# EAGLE schematic nixieShiftReg (EAGLE 9.0.1)
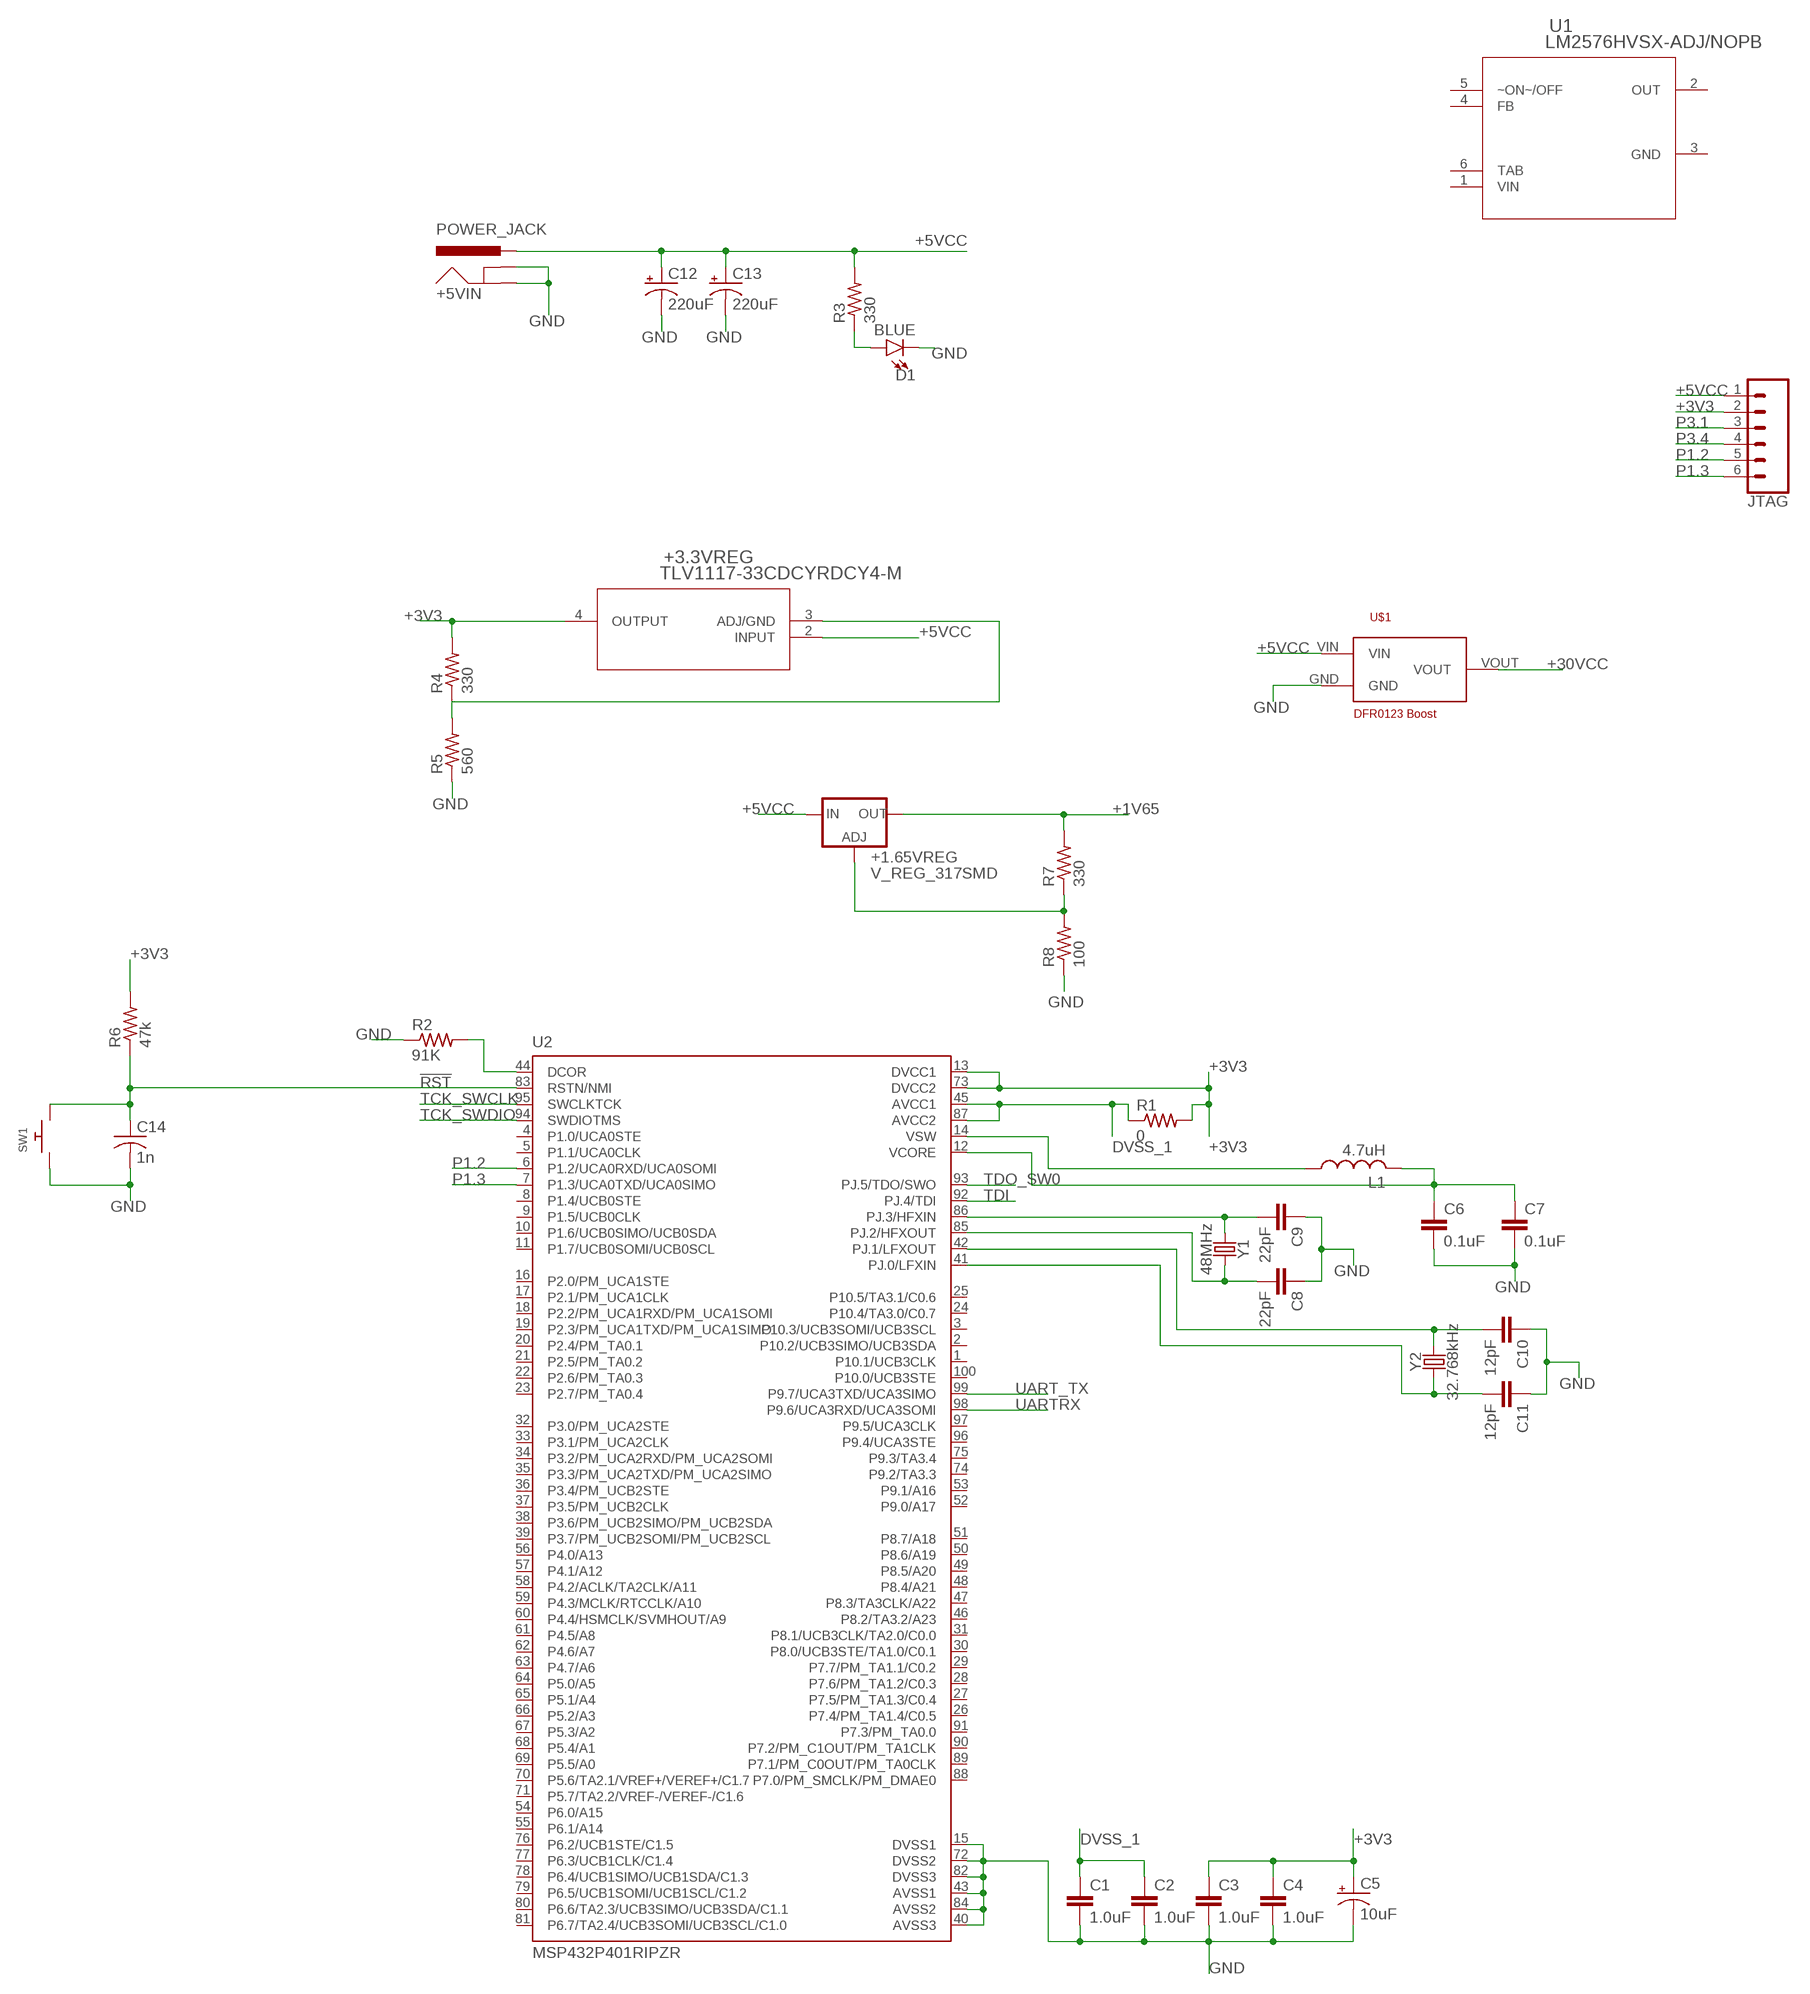
[diagram p0: schematic, sheet 1, part 1 of 2]
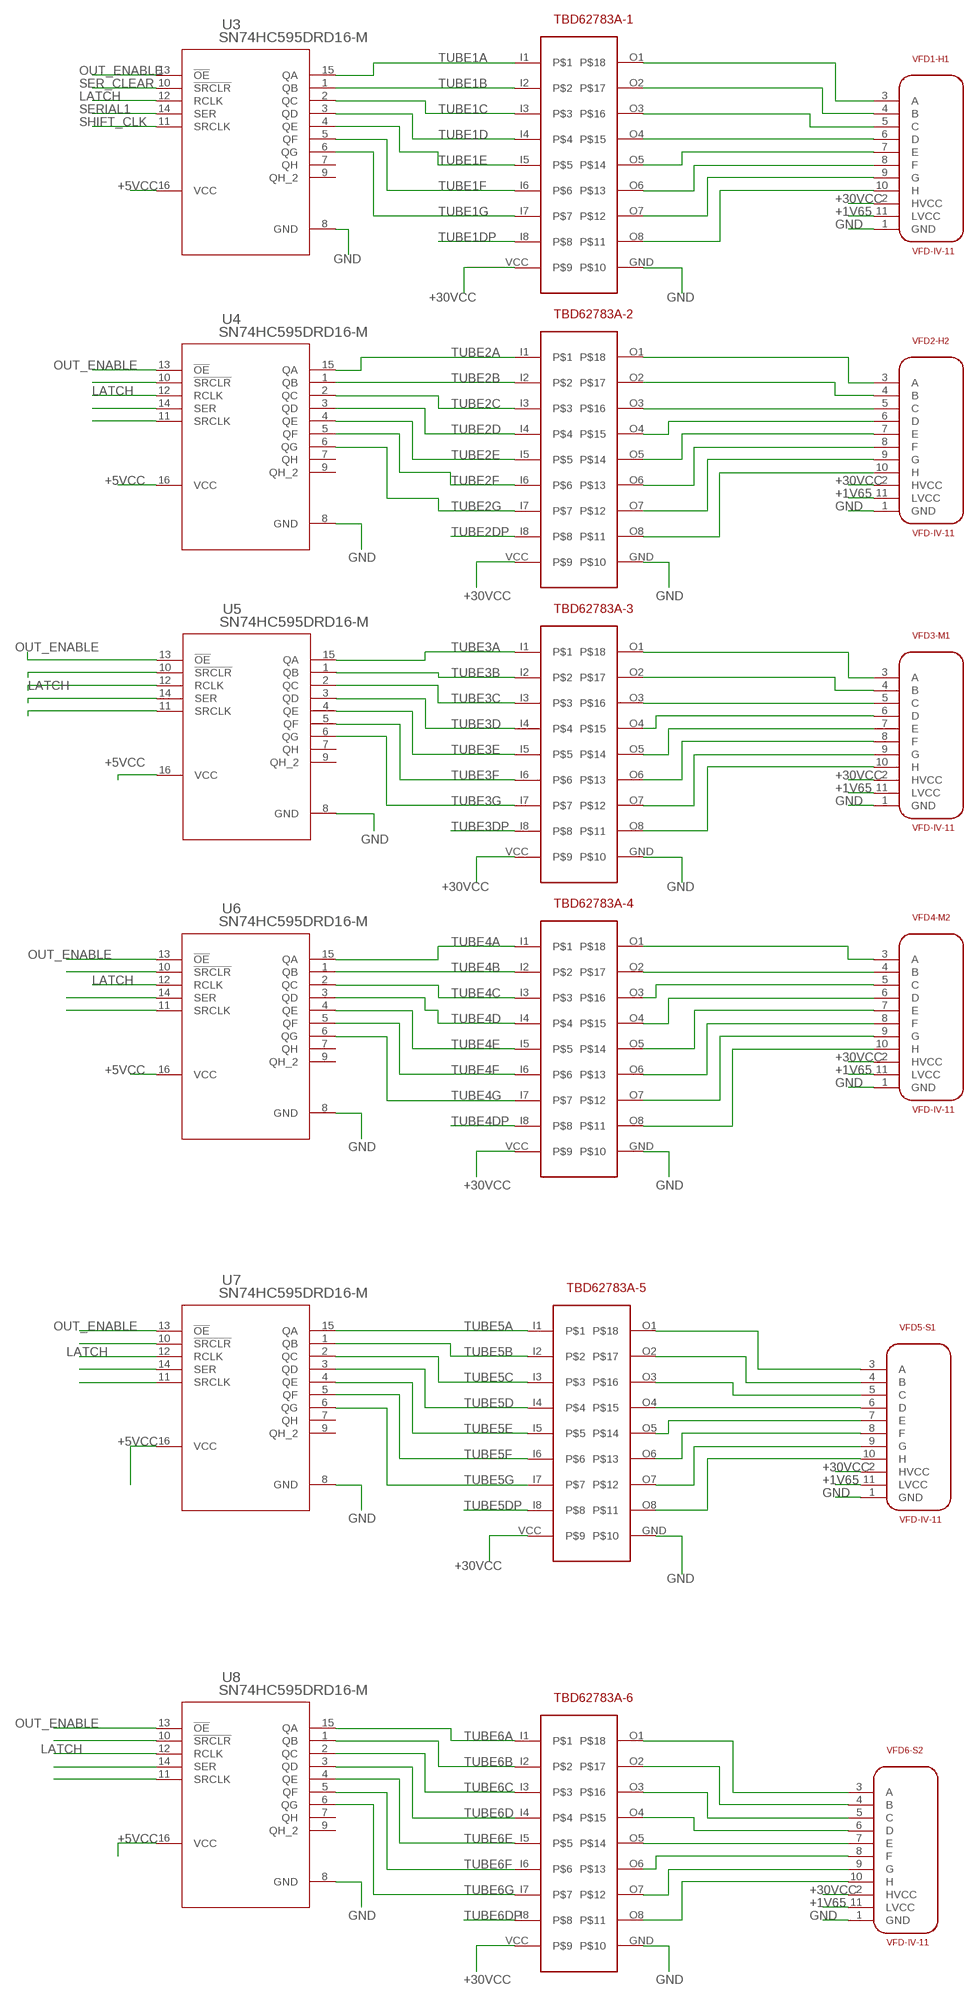
[diagram p1: schematic, sheet 1, part 2 of 2]

## Parts
+1.65VREG  V_REG_317SMD  [SOT223]
+3.3VREG  TLV1117-33CDCYRDCY4-M  [DCY4-M]
+5VIN  POWER_JACK  [POWER_JACK_PTH]
C1  1.0uF  1.0UF-0805-25V-(+80/-20%)  [0805]
C2  1.0uF  1.0UF-0805-25V-(+80/-20%)  [0805]
C3  1.0uF  1.0UF-0805-25V-(+80/-20%)  [0805]
C4  1.0uF  1.0UF-0805-25V-(+80/-20%)  [0805]
C5  10uF  10UF-POLAR-EIA3216-16V-10%(TANT)  [EIA3216]
C6  0.1uF  0.1UF-0603-25V-(+80/-20%)  [0603]
C7  0.1uF  0.1UF-0603-25V-(+80/-20%)  [0603]
C8  22pF  22PF-0603-50V-5%  [0603]
C9  22pF  22PF-0603-50V-5%  [0603]
C10  12pF  12PF-0603-50V-5%  [0603]
C11  12pF  12PF-0603-50V-5%  [0603]
C12  220uF  CPOL-USE2-5  [E2-5]
C13  220uF  CPOL-USE2-5  [E2-5]
C14  1n  C-USC0805K  [C0805K]
D1  BLUE  LED-BLUE1206  [LED-1206]
JTAG  CONN_06SILK_FEMALE_PTH  [1X06]
L1  4.7uH  L-USL0603  [L0603]
R1  0  R-US_MELF0204W  [MINI_MELF-0204W]
R2  91K  R-US_MELF0204W  [MINI_MELF-0204W]
R3  330  R-US_MELF0204W  [MINI_MELF-0204W]
R4  330  R-US_MELF0204W  [MINI_MELF-0204W]
R5  560  R-US_MELF0204W  [MINI_MELF-0204W]
R6  47k  R-US_MELF0204W  [MINI_MELF-0204W]
R7  330  R-US_MELF0204W  [MINI_MELF-0204W]
R8  100  R-US_MELF0204W  [MINI_MELF-0204W]
SW1  SWITCH_PUSHBUTTONSOFTTOUCHSMD_SJ  [PUSHBUTTON_SMD_SJ]
TBD62783A-1  TBD62783AFG  [TBD62783AFG]
TBD62783A-2  TBD62783AFG  [TBD62783AFG]
TBD62783A-3  TBD62783AFG  [TBD62783AFG]
TBD62783A-4  TBD62783AFG  [TBD62783AFG]
TBD62783A-5  TBD62783AFG  [TBD62783AFG]
TBD62783A-6  TBD62783AFG  [TBD62783AFG]
U1  LM2576HVSX-ADJ/NOPB  [TS5B]
U2  MSP432P401RIPZR  [QFP50P1600X1600X160-100N]
U3  SN74HC595DRD16-M  [D16-M]
U4  SN74HC595DRD16-M  [D16-M]
U5  SN74HC595DRD16-M  [D16-M]
U6  SN74HC595DRD16-M  [D16-M]
U7  SN74HC595DRD16-M  [D16-M]
U8  SN74HC595DRD16-M  [D16-M]
U$1  DFR0123  [DFR0123]
VFD1-H1  VFD-IV-11  [VFD-IV11]
VFD2-H2  VFD-IV-11  [VFD-IV11]
VFD3-M1  VFD-IV-11  [VFD-IV11]
VFD4-M2  VFD-IV-11  [VFD-IV11]
VFD5-S1  VFD-IV-11  [VFD-IV11]
VFD6-S2  VFD-IV-11  [VFD-IV11]
Y1  48MHz  CRYSTALSMD-3.2X2.5  [CRYSTAL-SMD-3.2X2.5MM]
Y2  32.768kHz  CRYSTAL-32.768KHZSMD-3.2X1.5  [CRYSTAL-SMD-3.2X1.5MM]

## Nets
!RST: C14.1 R6.1 SW1.P$2 U2.83(RSTN/NMI)
+1V65: +1.65VREG.2(OUT) R7.2 VFD1-H1.11(LVCC) VFD2-H2.11(LVCC) VFD3-M1.11(LVCC) VFD4-M2.11(LVCC) VFD5-S1.11(LVCC) VFD6-S2.11(LVCC)
+3V3: +3.3VREG.4(OUTPUT) C3.1 C4.1 C5.+ JTAG.2 R1.2 R4.2 R6.2 U2.13(DVCC1) U2.73(DVCC2)
+5VCC: +1.65VREG.3(IN) +3.3VREG.2(INPUT) +5VIN.PWR C12.+ C13.+ JTAG.1 R3.2 U3.16(VCC) U4.16(VCC) U5.16(VCC) U6.16(VCC) U7.16(VCC) U8.16(VCC) U$1.VIN
+30VCC: TBD62783A-1.VCC TBD62783A-2.VCC TBD62783A-3.VCC TBD62783A-4.VCC TBD62783A-5.VCC TBD62783A-6.VCC U$1.VOUT VFD1-H1.2(HVCC) VFD2-H2.2(HVCC) VFD3-M1.2(HVCC) VFD4-M2.2(HVCC) VFD5-S1.2(HVCC) VFD6-S2.2(HVCC)
DVSS_1: C1.1 C2.1 R1.1 U2.45(AVCC1) U2.87(AVCC2)
GND: +5VIN.GND +5VIN.GNDBREAK C1.2 C2.2 C3.2 C4.2 C5.- C6.2 C7.2 C8.1 C9.1 C10.1 C11.1 C12.- C13.- C14.2 D1.C R2.1 R5.1 R8.1 SW1.P$1 TBD62783A-1.GND TBD62783A-2.GND TBD62783A-3.GND TBD62783A-4.GND TBD62783A-5.GND TBD62783A-6.GND U2.15(DVSS1) U2.40(AVSS3) U2.43(AVSS1) U2.72(DVSS2) U2.82(DVSS3) U2.84(AVSS2) U3.8(GND) U4.8(GND) U5.8(GND) U6.8(GND) U7.8(GND) U8.8(GND) U$1.GND VFD1-H1.1(GND) VFD2-H2.1(GND) VFD3-M1.1(GND) VFD4-M2.1(GND) VFD5-S1.1(GND) VFD6-S2.1(GND)
LATCH: U3.12(RCLK) U4.12(RCLK) U5.12(RCLK) U6.12(RCLK) U7.12(RCLK) U8.12(RCLK)
N$1: L1.1 U2.14(VSW)
N$2: C8.2 U2.85(PJ.2/HFXOUT) Y1.3
N$3: C6.1 C7.1 L1.2 U2.12(VCORE)
N$4: C9.2 U2.86(PJ.3/HFXIN) Y1.1
N$5: C10.2 U2.42(PJ.1/LFXOUT) Y2.P$2
N$6: C11.2 U2.41(PJ.0/LFXIN) Y2.P$1
N$7: R2.2 U2.44(DCOR)
N$8: TBD62783A-1.O1 VFD1-H1.3(A)
N$9: TBD62783A-1.O2 VFD1-H1.4(B)
N$10: TBD62783A-1.O3 VFD1-H1.5(C)
N$11: TBD62783A-1.O4 VFD1-H1.6(D)
N$12: TBD62783A-1.O5 VFD1-H1.7(E)
N$13: TBD62783A-1.O6 VFD1-H1.8(F)
N$14: TBD62783A-1.O7 VFD1-H1.9(G)
N$15: TBD62783A-1.O8 VFD1-H1.10(H)
N$16: TBD62783A-2.O1 VFD2-H2.3(A)
N$17: TBD62783A-2.O2 VFD2-H2.4(B)
N$18: TBD62783A-2.O3 VFD2-H2.5(C)
N$19: TBD62783A-2.O4 VFD2-H2.6(D)
N$20: TBD62783A-2.O5 VFD2-H2.7(E)
N$21: TBD62783A-2.O6 VFD2-H2.8(F)
N$22: TBD62783A-2.O7 VFD2-H2.9(G)
N$23: TBD62783A-2.O8 VFD2-H2.10(H)
N$24: TBD62783A-5.O1 VFD5-S1.3(A)
N$25: TBD62783A-5.O2 VFD5-S1.4(B)
N$26: TBD62783A-3.O1 VFD3-M1.3(A)
N$27: TBD62783A-3.O2 VFD3-M1.4(B)
N$28: TBD62783A-3.O3 VFD3-M1.5(C)
N$29: TBD62783A-3.O4 VFD3-M1.6(D)
N$30: TBD62783A-3.O5 VFD3-M1.7(E)
N$31: TBD62783A-3.O6 VFD3-M1.8(F)
N$32: TBD62783A-3.O7 VFD3-M1.9(G)
N$33: TBD62783A-3.O8 VFD3-M1.10(H)
N$34: TBD62783A-4.O1 VFD4-M2.3(A)
N$35: TBD62783A-4.O2 VFD4-M2.4(B)
N$36: TBD62783A-4.O3 VFD4-M2.5(C)
N$37: TBD62783A-4.O4 VFD4-M2.6(D)
N$38: TBD62783A-4.O5 VFD4-M2.7(E)
N$39: TBD62783A-4.O6 VFD4-M2.8(F)
N$40: TBD62783A-4.O7 VFD4-M2.9(G)
N$41: TBD62783A-4.O8 VFD4-M2.10(H)
N$42: TBD62783A-6.O1 VFD6-S2.3(A)
N$43: TBD62783A-6.O2 VFD6-S2.4(B)
N$44: TBD62783A-6.O3 VFD6-S2.5(C)
N$45: TBD62783A-6.O4 VFD6-S2.6(D)
N$46: TBD62783A-6.O5 VFD6-S2.7(E)
N$47: TBD62783A-6.O6 VFD6-S2.8(F)
N$48: TBD62783A-6.O7 VFD6-S2.9(G)
N$49: TBD62783A-6.O8 VFD6-S2.10(H)
N$50: TBD62783A-5.O3 VFD5-S1.5(C)
N$51: TBD62783A-5.O4 VFD5-S1.6(D)
N$52: TBD62783A-5.O5 VFD5-S1.7(E)
N$53: TBD62783A-5.O6 VFD5-S1.8(F)
N$54: TBD62783A-5.O7 VFD5-S1.9(G)
N$55: TBD62783A-5.O8 VFD5-S1.10(H)
N$56: D1.A R3.1
N$57: U6.14(SER)
N$58: +1.65VREG.1(ADJ) R7.1 R8.2
N$59: +3.3VREG.3(ADJ/GND) R4.1 R5.2
N$61: U4.10(!SRCLR)
N$63: U4.14(SER)
N$64: U4.11(SRCLK)
N$66: U5.10(!SRCLR)
N$68: U5.14(SER)
N$69: U5.11(SRCLK)
N$71: U6.10(!SRCLR)
N$72: U6.11(SRCLK)
N$74: U7.10(!SRCLR)
N$76: U7.14(SER)
N$77: U7.11(SRCLK)
N$79: U8.10(!SRCLR)
N$81: U8.14(SER)
N$82: U8.11(SRCLK)
OUT_ENABLE: U3.13(!OE) U4.13(!OE) U5.13(!OE) U6.13(!OE) U7.13(!OE) U8.13(!OE)
P1.2: JTAG.5 U2.6(P1.2/UCA0RXD/UCA0SOMI)
P1.3: JTAG.6 U2.7(P1.3/UCA0TXD/UCA0SIMO)
P3.1: JTAG.3
P3.4: JTAG.4
SER_CLEAR: U3.10(!SRCLR)
SERIAL1: U3.14(SER)
SHIFT_CLK: U3.11(SRCLK)
TCK_SWCLK: U2.95(SWCLKTCK)
TCK_SWDIO: U2.94(SWDIOTMS)
TDI: U2.92(PJ.4/TDI)
TDO_SW0: U2.93(PJ.5/TDO/SWO)
TUBE1A: TBD62783A-1.I1 U3.15(QA)
TUBE1B: TBD62783A-1.I2 U3.1(QB)
TUBE1C: TBD62783A-1.I3 U3.2(QC)
TUBE1D: TBD62783A-1.I4 U3.3(QD)
TUBE1DP: TBD62783A-1.I8
TUBE1E: TBD62783A-1.I5 U3.4(QE)
TUBE1F: TBD62783A-1.I6 U3.5(QF)
TUBE1G: TBD62783A-1.I7 U3.6(QG)
TUBE2A: TBD62783A-2.I1 U4.15(QA)
TUBE2B: TBD62783A-2.I2 U4.1(QB)
TUBE2C: TBD62783A-2.I3 U4.2(QC)
TUBE2D: TBD62783A-2.I4 U4.3(QD)
TUBE2DP: TBD62783A-2.I8
TUBE2E: TBD62783A-2.I5 U4.4(QE)
TUBE2F: TBD62783A-2.I6 U4.5(QF)
TUBE2G: TBD62783A-2.I7 U4.6(QG)
TUBE3A: TBD62783A-3.I1 U5.15(QA)
TUBE3B: TBD62783A-3.I2 U5.1(QB)
TUBE3C: TBD62783A-3.I3 U5.2(QC)
TUBE3D: TBD62783A-3.I4 U5.3(QD)
TUBE3DP: TBD62783A-3.I8
TUBE3E: TBD62783A-3.I5 U5.4(QE)
TUBE3F: TBD62783A-3.I6 U5.5(QF)
TUBE3G: TBD62783A-3.I7 U5.6(QG)
TUBE4A: TBD62783A-4.I1 U6.15(QA)
TUBE4B: TBD62783A-4.I2 U6.1(QB)
TUBE4C: TBD62783A-4.I3 U6.2(QC)
TUBE4D: TBD62783A-4.I4 U6.3(QD)
TUBE4DP: TBD62783A-4.I8
TUBE4E: TBD62783A-4.I5 U6.4(QE)
TUBE4F: TBD62783A-4.I6 U6.5(QF)
TUBE4G: TBD62783A-4.I7 U6.6(QG)
TUBE5A: TBD62783A-5.I1 U7.15(QA)
TUBE5B: TBD62783A-5.I2 U7.1(QB)
TUBE5C: TBD62783A-5.I3 U7.2(QC)
TUBE5D: TBD62783A-5.I4 U7.3(QD)
TUBE5DP: TBD62783A-5.I8
TUBE5E: TBD62783A-5.I5 U7.4(QE)
TUBE5F: TBD62783A-5.I6 U7.5(QF)
TUBE5G: TBD62783A-5.I7 U7.6(QG)
TUBE6A: TBD62783A-6.I1 U8.15(QA)
TUBE6B: TBD62783A-6.I2 U8.1(QB)
TUBE6C: TBD62783A-6.I3 U8.2(QC)
TUBE6D: TBD62783A-6.I4 U8.3(QD)
TUBE6DP: TBD62783A-6.I8
TUBE6E: TBD62783A-6.I5 U8.4(QE)
TUBE6F: TBD62783A-6.I6 U8.5(QF)
TUBE6G: TBD62783A-6.I7 U8.6(QG)
UART_TX: U2.99(P9.7/UCA3TXD/UCA3SIMO)
UARTRX: U2.98(P9.6/UCA3RXD/UCA3SOMI)
Unconnected: U1.4(FB) U1.5(~ON~/OFF) U2.1(P10.1/UCB3CLK) U2.2(P10.2/UCB3SIMO/UCB3SDA) U2.3(P10.3/UCB3SOMI/UCB3SCL) U2.4(P1.0/UCA0STE) U2.5(P1.1/UCA0CLK) U2.8(P1.4/UCB0STE) U2.9(P1.5/UCB0CLK) U2.10(P1.6/UCB0SIMO/UCB0SDA) U2.11(P1.7/UCB0SOMI/UCB0SCL) U2.16(P2.0/PM_UCA1STE) U2.17(P2.1/PM_UCA1CLK) U2.18(P2.2/PM_UCA1RXD/PM_UCA1SOMI) U2.19(P2.3/PM_UCA1TXD/PM_UCA1SIMO) U2.20(P2.4/PM_TA0.1) U2.21(P2.5/PM_TA0.2) U2.22(P2.6/PM_TA0.3) U2.23(P2.7/PM_TA0.4) U2.24(P10.4/TA3.0/C0.7) U2.25(P10.5/TA3.1/C0.6) U2.26(P7.4/PM_TA1.4/C0.5) U2.27(P7.5/PM_TA1.3/C0.4) U2.28(P7.6/PM_TA1.2/C0.3) U2.29(P7.7/PM_TA1.1/C0.2) U2.30(P8.0/UCB3STE/TA1.0/C0.1) U2.31(P8.1/UCB3CLK/TA2.0/C0.0) U2.32(P3.0/PM_UCA2STE) U2.33(P3.1/PM_UCA2CLK) U2.34(P3.2/PM_UCA2RXD/PM_UCA2SOMI) U2.35(P3.3/PM_UCA2TXD/PM_UCA2SIMO) U2.36(P3.4/PM_UCB2STE) U2.37(P3.5/PM_UCB2CLK) U2.38(P3.6/PM_UCB2SIMO/PM_UCB2SDA) U2.39(P3.7/PM_UCB2SOMI/PM_UCB2SCL) U2.46(P8.2/TA3.2/A23) U2.47(P8.3/TA3CLK/A22) U2.48(P8.4/A21) U2.49(P8.5/A20) U2.50(P8.6/A19) U2.51(P8.7/A18) U2.52(P9.0/A17) U2.53(P9.1/A16) U2.54(P6.0/A15) U2.55(P6.1/A14) U2.56(P4.0/A13) U2.57(P4.1/A12) U2.58(P4.2/ACLK/TA2CLK/A11) U2.59(P4.3/MCLK/RTCCLK/A10) U2.60(P4.4/HSMCLK/SVMHOUT/A9) U2.61(P4.5/A8) U2.62(P4.6/A7) U2.63(P4.7/A6) U2.64(P5.0/A5) U2.65(P5.1/A4) U2.66(P5.2/A3) U2.67(P5.3/A2) U2.68(P5.4/A1) U2.69(P5.5/A0) U2.70(P5.6/TA2.1/VREF+/VEREF+/C1.7) U2.71(P5.7/TA2.2/VREF-/VEREF-/C1.6) U2.74(P9.2/TA3.3) U2.75(P9.3/TA3.4) U2.76(P6.2/UCB1STE/C1.5) U2.77(P6.3/UCB1CLK/C1.4) U2.78(P6.4/UCB1SIMO/UCB1SDA/C1.3) U2.79(P6.5/UCB1SOMI/UCB1SCL/C1.2) U2.80(P6.6/TA2.3/UCB3SIMO/UCB3SDA/C1.1) U2.81(P6.7/TA2.4/UCB3SOMI/UCB3SCL/C1.0) U2.88(P7.0/PM_SMCLK/PM_DMAE0) U2.89(P7.1/PM_C0OUT/PM_TA0CLK) U2.90(P7.2/PM_C1OUT/PM_TA1CLK) U2.91(P7.3/PM_TA0.0) U2.96(P9.4/UCA3STE) U2.97(P9.5/UCA3CLK) U2.100(P10.0/UCB3STE) U3.7(QH) U3.9(QH_2) U4.7(QH) U4.9(QH_2) U5.7(QH) U5.9(QH_2) U6.7(QH) U6.9(QH_2) U7.7(QH) U7.9(QH_2) U8.7(QH) U8.9(QH_2)

## Power pins joined to a net without a drawn wire
GND: U1.3(GND)
OUT: U1.2(OUT)
TAB: U1.6(TAB)
VIN: U1.1(VIN)

## Library data of the parts
+1.65VREG = SparkFun-IC-Power:V_REG_317: Voltage Regulator Standard LM317 adjustable voltage regulator. AOI (Adjust Output Input). Google 'LM317 Calculator' for easy to use app to get the two resistor values needed. 240/720 for 5V output. 240/390 for 3.3V output. Spark Fun Electronics SKU : COM-00527
+3.3VREG = TLV1117:TLV1117-33CDCYR; MANUFACTURER_PART_NUMBER: TLV111733CDCYR; VENDOR: Texas Instruments
+5VIN = SparkFun-Connectors:POWER_JACK: Power Jack Connector This is the standard 5.5mm barrel jack for power. The PTH is the most common, proven, reliable, footprint. The Slot footprint only works if the mill layer is transmitted to the PCB fab house so be warned. Here are the connectors we sell at SparkFun: DC Barrel Power Jack/Connector <https://www.sparkfun.com/products/119> (PRT-00119) DC Barrel Power Jack/Connector (SMD) <https://www.sparkfun.com/products/12748> (PRT-12748) DC Barrel Jack Adapter - Breadboard Compatible <https://www.sparkfun.com/products/10811> (PRT-10811) It is used on this SparkFun product (and many, many others): SparkFun RedBoard - Programmed with Arduino <https://www.sparkfun.com/products/12757> (DEV-12757) Also, if you need a mating power supply or connector, please check these out: Wall Adapter Power Supply - 9VDC 650mA <https://www.sparkfun.com/products/298> (TOL-00298) DC Barrel Jack Adapter - Male <https://www.sparkfun.com/products/10287> (PRT-10287); PROD_ID: CONN-08197
C1-C4 = SparkFun-Capacitors:1.0UF: 1µF ceramic capacitors A capacitor is a passive two-terminal electrical component used to store electrical energy temporarily in an electric field.; PROD_ID: CAP-11625
C5 = SparkFun-Capacitors:10UF-POLAR: 10.0µF polarized capacitors A capacitor is a passive two-terminal electrical component used to store electrical energy temporarily in an electric field.; PROD_ID: CAP-00811
C6 C7 = SparkFun-Capacitors:0.1UF: 0.1µF ceramic capacitors A capacitor is a passive two-terminal electrical component used to store electrical energy temporarily in an electric field.; PROD_ID: CAP-00810
C8 C9 = SparkFun-Capacitors:22PF: 22pF ceramic capacitors A capacitor is a passive two-terminal electrical component used to store electrical energy temporarily in an electric field.; PROD_ID: CAP-07876
C10 C11 = SparkFun-Capacitors:12PF: 12pF ceramic capacitors A capacitor is a passive two-terminal electrical component used to store electrical energy temporarily in an electric field.; PROD_ID: CAP-09137
C12 C13 = rcl:CPOL-US: POLARIZED CAPACITOR, American symbol; SPICEPREFIX: C
C14 = rcl:C-US: CAPACITOR, American symbol; SPICEPREFIX: C
D1 = SparkFun-LED:LED-BLUE: Blue SMD LED Used in manufacturing of various products at SparkFun Packages: 0603 - SMD 0603 package [Product Link] <http://www.digikey.com/product-detail/en/SMLE12BC7TT86/511-1589-2-ND/1641808> 1206 - SMD1206 package [Product Link] <http://www.digikey.com/product-detail/en/lite-on-inc/LTST-C150TBKT/160-1643-1-ND/573584> SparkFun Products: ESP8266 Thing-Dev Board <https://www.sparkfun.com/products/13711> RedBoard <https://www.sparkfun.com/products/12757>; PROD_ID: DIO-09911
JTAG = SparkFun-Connectors:CONN_06: Multi connection point. Often used as Generic Header-pin footprint for 0.1 inch spaced/style header connections On any of the 0.1 inch spaced packages, you can populate with these: Break Away Headers - Straight <https://www.sparkfun.com/products/116> (PRT-00116) Break Away Male Headers - Right Angle <https://www.sparkfun.com/products/553> (PRT-00553) Female Headers <https://www.sparkfun.com/products/115> (PRT-00115) Break Away Headers - Machine Pin <https://www.sparkfun.com/products/117> (PRT-00117) Break Away Female Headers - Swiss Machine Pin <https://www.sparkfun.com/products/743> (PRT-00743) Arduino Stackable Header - 6 Pin <https://www.sparkfun.com/products/9280> (PRT-09280) For SCREWTERMINALS and SPRING TERMINALS visit here: Screw Terimnals on SparkFun.com <https://www.sparkfun.com/search/results?term=Screw+Terminals> (5mm/3.5mm/2.54mm spacing) This device is also useful as a general connection point to wire up your design to another part of your project. Our various solder wires solder well into these plated through hole pads. Hook-Up Wire - Assortment (Stranded, 22 AWG) <https://www.sparkfun.com/products/11375> (PRT-11375) Hook-Up Wire - Assortment (Solid Core, 22 AWG) <https://www.sparkfun.com/products/11367> (PRT-11367) View the entire wire category on our website here <https://www.sparkfun.com/categories/141>; PROD_ID: CONN-08437
L1 = rcl:L-US: INDUCTOR, American symbol
R1-R8 = rcl:R-US_: RESISTOR, American symbol; SPICEPREFIX: R
SW1 = adafruit:SWITCH_PUSHBUTTON: Buttons SOFTTOUCHSMD_SJ - Soft touch temporary push button (Super Junk Akihabara) Compatible with SKPMANE010 [Mouser: 688-SKPMAN] C&K_KSS = Digikey: KSS221GLFS
TBD62783A-1-TBD62783A-6 = TBD62783AFG:TBD62783AFG
U1 = LM2576HVSX-ADJ:LM2576HVSX-ADJ/NOPB; MANUFACTURER_PART_NUMBER: LM2576HVSXADJNOPB; VENDOR: Texas Instruments
U2 = MSP432P401RIPZR:MSP432P401RIPZR: Low-Power and High Performance 32-Bit ARM Cortex M4F With 256KB Flash and 64KB RAM 100-LQFP -40 to 85; AVAILABILITY: Good; DESCRIPTION: Low-Power and High Performance 32-Bit ARM Cortex M4F With 256KB Flash and 64KB RAM 100-LQFP -40 to 85; MF: Texas Instruments; MP: MSP432P401RIPZR; PACKAGE: LQFP-100 Texas Instruments; PRICE: 5.56 USD
U3-U8 = tiShiftRegister:SN74HC595DR; MANUFACTURER_PART_NUMBER: SN74HC595DR; VENDOR: Vendor
U$1 = DFR0123:DFR0123
VFD1-H1 VFD2-H2 VFD3-M1 VFD4-M2 VFD5-S1 VFD6-S2 = IV-11 VFD Tube:VFD-IV-11
Y1 = SparkFun-Clocks:CRYSTAL: Crystals (Generic) These are passive quartz crystals, which can be used as a clock source for a microcontroller. Crystal's are two-terminal devices. They require external "load" capacitors to generate an oscillating signal.
Y2 = SparkFun-Clocks:CRYSTAL-32.768KHZ: 32.768kHz Crystal Frequency: 32.768kHz Frequency Stability: ±20ppm Load Capacitance: 12.5pF (PTH-2X6 & SMD-3.2X1.5), 6pF (SMD-2X6) SparkFun Products: SparkFun BigTime Watch Kit <https://www.sparkfun.com/products/11734> SparkFun nRF52832 Breakout <https://www.sparkfun.com/products/13990> SparkFun Real Time Clock Module <https://www.sparkfun.com/products/12708>; PROD_ID: XTAL-13062